# Altium project GO_CART.PrjPcb
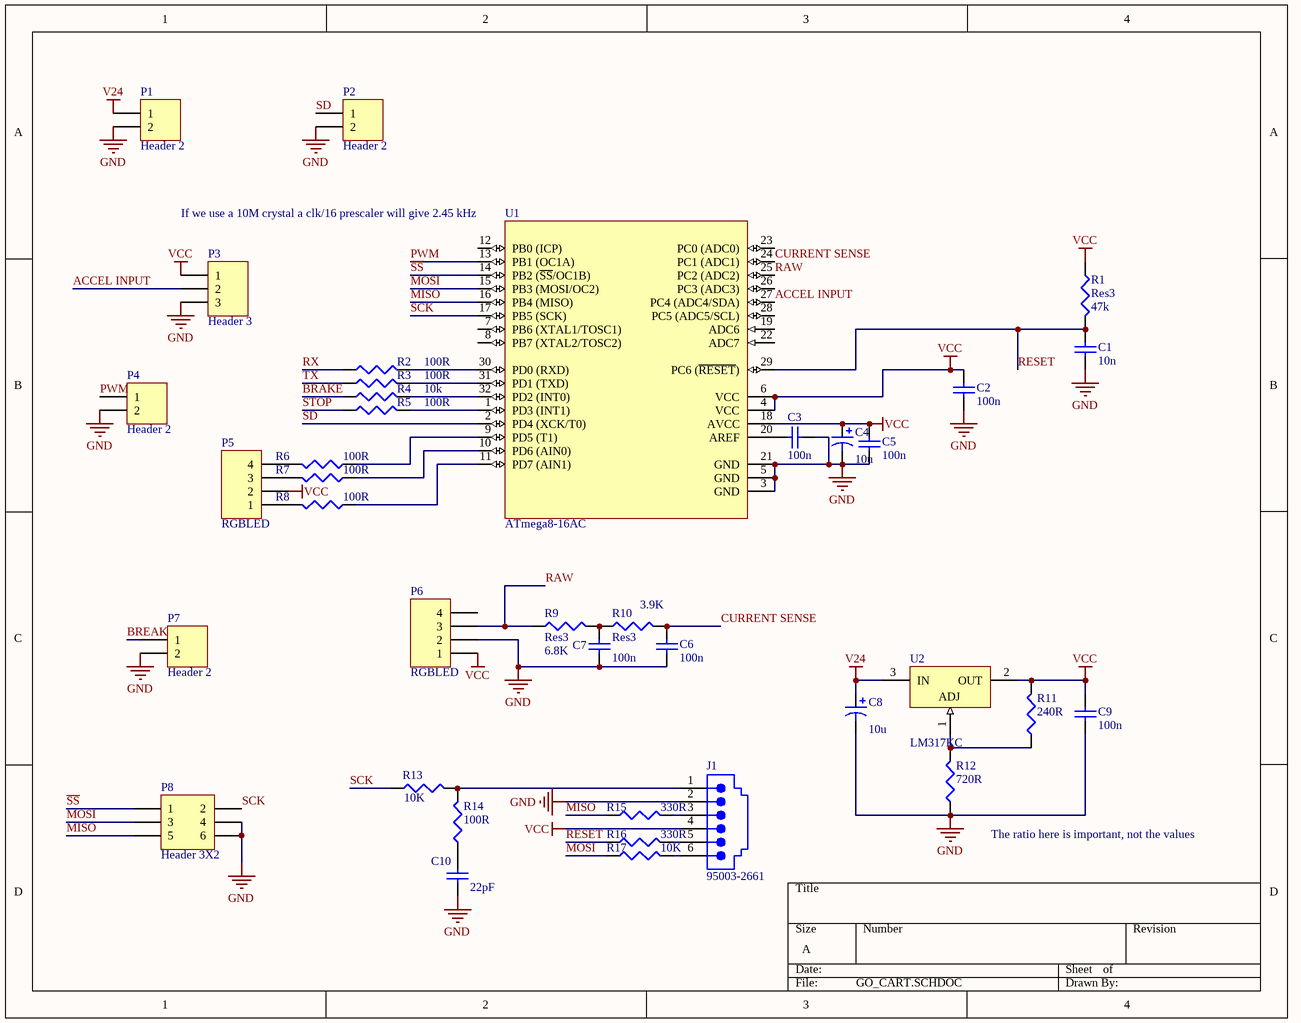
[diagram p0: GO_CART.SCHDOC]
1 sheet, 38 parts. Net scope: global (net labels, ports and power ports of the same name join across sheets).
Board file: GOCARTPCB.PcbDoc

## Sheet GO_CART.SCHDOC
size A

### Parts
C1  value 10n  [AXIAL-0.3]
C2  value 100n  [AXIAL-0.3]
C3  value 100n  [AXIAL-0.3]
C4  value 10u  [B]
C5  value 100n  [AXIAL-0.3]
C6  value 100n  [AXIAL-0.3]
C7  value 100n  [AXIAL-0.3]
C8  value 10u  [B]
C9  value 100n  [AXIAL-0.3]
C10  value 22pF  [AXIAL-0.3]
J1  95003-2661  [95003-2661]
P1  Header 2  [HDR1X2]
P2  Header 2  [HDR1X2]
P3  Header 3  [HDR1X3]
P4  Header 2  [HDR1X2]
P5  RGBLED  [HDR1X4]
P6  RGBLED  [HDR1X4]
P7  Header 2  [HDR1X2]
P8  Header 3X2  [HDR2X3]
R1  Res3  value 47k  [AXIAL-0.4]
R2  value 100R  [AXIAL-0.4]
R3  value 100R  [AXIAL-0.4]
R4  value 10k  [AXIAL-0.4]
R5  value 100R  [AXIAL-0.4]
R6  value 100R  [AXIAL-0.4]  (hidden comment: Res3)
R7  value 100R  [AXIAL-0.4]  (hidden comment: Res3)
R8  value 100R  [AXIAL-0.4]  (hidden comment: Res3)
R9  Res3  value 6.8K  [AXIAL-0.4]
R10  Res3  value 3.9K  [AXIAL-0.4]
R11  value 240R  [AXIAL-0.4]  (hidden comment: Res3)
R12  value 720R  [AXIAL-0.4]  (hidden comment: Res3)
R13  value 10K  [AXIAL-0.4]  (hidden comment: Res3)
R14  value 100R  [AXIAL-0.4]  (hidden comment: Res3)
R15  value 330R  [AXIAL-0.4]  (hidden comment: Res3)
R16  value 330R  [AXIAL-0.4]  (hidden comment: Res3)
R17  value 10K  [AXIAL-0.4]  (hidden comment: Res3)
U1  ATmega8-16AC  [32A_N]
U2  LM317KC  [KC03]

### Nets
GND: C1.2 C2.2 C3.1 C4.2 C5.2 C6.2 C7.2 C8.2 C9.2 C10.2 J1.2 P1.2 P2.2 P3.3 P4.2 P6.2 P7.2 P8.4 P8.6 R12.1 U1.3(GND) U1.5(GND) U1.21(GND)
V24: C8.1 P1.1 U2.3(IN)
VCC: C2.1 C4.1 C5.1 C9.1 J1.4 P3.1 P5.2 P6.1 R1.1 R11.2 U1.4(VCC) U1.6(VCC) U1.18(AVCC) U2.2(OUT)
ACCEL INPUT: P3.2 U1.27(PC4_(ADC4/SDA))
BRAKE: R4.1
BREAK: P7.1
CURRENT SENSE: C6.1 R10.2 U1.24(PC1_(ADC1))
MISO: P8.5 R15.1 U1.16(PB4_(MISO))
MOSI: P8.3 R17.1 U1.15(PB3_(MOSI/OC2))
PWM: P4.1 U1.13(PB1_(OC1A))
RAW: P6.3 R9.1 U1.25(PC2_(ADC2))
RESET: C1.1 R1.2 R16.1 U1.29(PC6_(~{RESET}))
RX: R2.1
~{SS}: P8.1 U1.14(PB2_(~{SS}/OC1B))
SCK: P8.2 R13.1 U1.17(PB5_(SCK))
SD: P2.1 U1.2(PD4_(XCK/T0))
STOP: R5.1
TX: R3.1
NetC3_2: C3.2 U1.20(AREF)
NetC7_1: C7.1 R9.2 R10.1
NetC10_1: C10.1 R14.1
NetJ1_1: J1.1 R13.2 R14.2
NetJ1_3: J1.3 R15.2
NetJ1_5: J1.5 R16.2
NetJ1_6: J1.6 R17.2
NetP5_1: P5.1 R8.2
NetP5_3: P5.3 R7.2
NetP5_4: P5.4 R6.2
NetR2_2: R2.2 U1.30(PD0_(RXD))
NetR3_2: R3.2 U1.31(PD1_(TXD))
NetR4_2: R4.2 U1.32(PD2_(INT0))
NetR5_2: R5.2 U1.1(PD3_(INT1))
NetR6_1: R6.1 U1.9(PD5_(T1))
NetR7_1: R7.1 U1.10(PD6_(AIN0))
NetR8_1: R8.1 U1.11(PD7_(AIN1))
NetR11_1: R11.1 R12.2 U2.1(ADJ)

Not connected (* = marked no-connect by the designer): P6 4; U1 7(PB6_(XTAL1/TOSC1)) 8(PB7_(XTAL2/TOSC2)) 12(PB0_(ICP)) 19(ADC6) 22(ADC7) 23(PC0_(ADC0)) 26(PC3_(ADC3)) 28(PC5_(ADC5/SCL))

### Notes on the sheet
- (near U1) If we use a 10M crystal a clk/16 prescaler will give 2.45 kHz
- (near R12) The ratio here is important, not the values

### Library data of the parts
C1-C3 C5-C7 C9 C10 = Cap: Capacitor; Published: 8-Jun-2000; LatestRevisionDate: 17-Jul-2002; LatestRevisionNote: Re-released for DXP Platform.; PackageReference: RAD-0.3; Publisher: Altium Limited
C4 C8 = Cap Pol1: Polarized Capacitor (Radial); Published: 8-Jun-2000; LatestRevisionDate: 17-Jul-2002; LatestRevisionNote: Re-released for DXP Platform.; PackageReference: RB7.6-15; Publisher: Altium Limited
J1 = 95003-2661: Vertical, Standard Profile with Small Panel Cutout PCB Jack; Ports: 1; Positions/Loaded: Port1 - 6/6; PerformanceCategory: 3; PCB_Mounting: Thru-Hole; DrillSize: Nominal, Rounded to nearest 0.05mm; PCB_Layout: Complies with Manufacturer's Recommendation.; Published: 25-Jun-2002; DatasheetDocument: 20-Nov-2001; PackageDocument: 20-Nov-2001; PackageReference: 95003-2661; Publisher: Altium Limited; ComponentLink1Description: Manufacturer Link; ComponentLink1URL: http://www.molex.com/; ComponentLink2Description: Datasheet; ComponentLink2URL: http://www.molex.com/cmc_upload/common_files/1222003_mx95003b.pdf; ComponentLink3Description: Iges Model; ComponentLink3URL: http://www.molex.com/pdm_docs/igs/95003-2441_igs.zip
P1 P2 P4 P7 = Header 2: Header, 2-Pin; LatestRevisionDate: 17-Jul-2002; LatestRevisionNote: Re-released for DXP Platform.; Publisher: Altium Limited
P3 = Header 3: Header, 3-Pin; LatestRevisionDate: 17-Jul-2002; LatestRevisionNote: Re-released for DXP Platform.; Publisher: Altium Limited
P5 P6 = Header 4: Header, 4-Pin; LatestRevisionDate: 17-Jul-2002; LatestRevisionNote: Re-released for DXP Platform.; Publisher: Altium Limited
P8 = Header 3X2: Header, 3-Pin, Dual row; LatestRevisionDate: 17-Jul-2002; LatestRevisionNote: Re-released for DXP Platform.; Publisher: Altium Limited
R1-R17 = Res3: Resistor; Published: 8-Jun-2000; LatestRevisionDate: 04-Mar-2005; LatestRevisionNote: PCB Footprint replaced.; PackageReference: J1-0603; Publisher: Altium Limited
U1 = ATmega8-16AC: 8-Bit AVR Microcontroller with 8K Bytes of In-System Programmable Flash Memory; Published: 17-Sep-2003; LatestRevisionDate: 13-Apr-2006; LatestRevisionNote: IPC-7351 Footprint Added.; DatasheetVersion: 2486H-AVR-09/02; PackageVersion: revB, Oct-2001; PackageReference: 32A; Publisher: Altium Limited; PackageDescription: 32-Pin Thin Quad Flat Pack 0.8 mm Pitch; Code_JEDEC: MS-026-ABA; ComponentLink1Description: Manufacturer Link; ComponentLink1URL: http://www.atmel.com; ComponentLink2Description: Datasheet; ComponentLink2URL: http://www.atmel.com/dyn/resources/prod_documents/doc2486.pdf
U2 = LM317KC: 3-Terminal Adjustable Regulator; Note: Pin 2 is electrically connected to tab; Published: 15-Apr-2002; DatasheetVersion: Feb-1988; PackageVersion: Sep-1995; PackageReference: KC03; Publisher: Altium Limited; PackageDescription: TO, Thru-Hole, Vertical, Heatsink Mounted; 3 In-Line Leads; Pitch 2.54 mm; ComponentLink1Description: Manufacturer Link; ComponentLink1URL: http://www.ti.com/